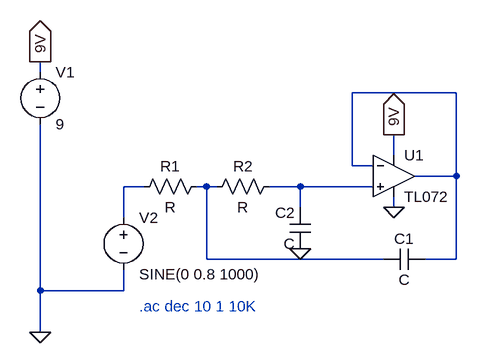
[diagram p0: schematic Draft1.asc]
Draft1.asc, the LTspice schematic file:
Version 4
SHEET 1 940 680
WIRE -96 160 -96 144
WIRE 544 192 384 192
WIRE 448 288 448 256
WIRE 384 304 384 192
WIRE 416 304 384 304
WIRE 544 320 544 192
WIRE 544 320 480 320
WIRE 64 336 32 336
WIRE 160 336 144 336
WIRE 176 336 160 336
WIRE 304 336 256 336
WIRE 416 336 304 336
WIRE 304 368 304 336
WIRE 448 368 448 352
WIRE 32 384 32 336
WIRE 160 448 160 336
WIRE 432 448 160 448
WIRE 544 448 544 320
WIRE 544 448 496 448
WIRE -96 496 -96 240
WIRE 32 496 32 464
WIRE 32 496 -96 496
WIRE -96 560 -96 496
FLAG 448 368 0
FLAG -96 560 0
FLAG -96 144 9V
IOPIN -96 144 Out
FLAG 448 256 9V
IOPIN 448 256 Out
FLAG 304 432 0
SYMBOL TL072 448 256 R0
SYMATTR InstName U1
SYMBOL voltage -96 144 R0
WINDOW 123 0 0 Left 0
WINDOW 39 0 0 Left 0
SYMATTR InstName V1
SYMATTR Value 9
SYMBOL voltage 32 368 R0
WINDOW 3 24 103 Left 2
WINDOW 123 24 124 Left 2
WINDOW 39 0 0 Left 0
SYMATTR Value SINE(0 0.8 1000)
SYMATTR InstName V2
SYMBOL res 160 320 R90
WINDOW 0 0 56 VBottom 2
WINDOW 3 32 56 VTop 2
SYMATTR InstName R1
SYMBOL res 272 320 R90
WINDOW 0 0 56 VBottom 2
WINDOW 3 32 56 VTop 2
SYMATTR InstName R2
SYMBOL cap 496 432 R90
WINDOW 0 0 32 VBottom 2
WINDOW 3 32 32 VTop 2
SYMATTR InstName C1
SYMBOL cap 320 432 R180
WINDOW 0 24 56 Left 2
WINDOW 3 24 8 Left 2
SYMATTR InstName C2
TEXT 56 520 Left 2 ;.ac dec 10 1 10K

The netlist it stands for:
* Draft1.asc
* U1: TL072 (symbol TL072 not available, pins judged from their places): In+=N004 In-=N001 V+=9V V-=0 OUT=N001
V1 9V 0 9
V2 N002 0 SINE(0 0.8 1000)
R1 N003 N002 R
R2 N004 N003 R
C1 N001 N003 C
C2 0 N004 C
* .ac dec 10 1 10K
.backanno
.end